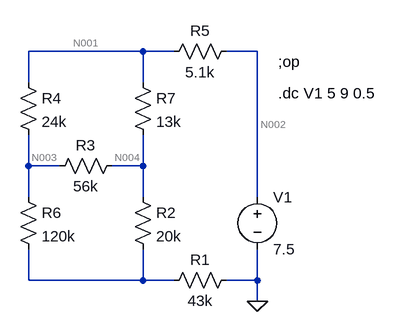
[diagram p0: schematic lab4.asc]
lab4.asc, the LTspice schematic file:
Version 4
SHEET 1 880 680
WIRE 208 -80 32 -80
WIRE 256 -80 208 -80
WIRE 384 -80 336 -80
WIRE 32 -32 32 -80
WIRE 208 -32 208 -80
WIRE 32 96 32 48
WIRE 80 96 32 96
WIRE 208 96 208 48
WIRE 208 96 160 96
WIRE 32 144 32 96
WIRE 208 144 208 96
WIRE 384 144 384 -80
WIRE 32 272 32 224
WIRE 208 272 208 224
WIRE 208 272 32 272
WIRE 256 272 208 272
WIRE 384 272 384 224
WIRE 384 272 336 272
WIRE 384 304 384 272
FLAG 384 304 0
SYMBOL res 352 256 R90
WINDOW 0 0 56 VBottom 2
WINDOW 3 32 56 VTop 2
SYMATTR InstName R1
SYMATTR Value 43k
SYMBOL res 192 128 R0
SYMATTR InstName R2
SYMATTR Value 20k
SYMBOL res 176 80 R90
WINDOW 0 0 56 VBottom 2
WINDOW 3 32 56 VTop 2
SYMATTR InstName R3
SYMATTR Value 56k
SYMBOL res 16 -48 R0
SYMATTR InstName R4
SYMATTR Value 24k
SYMBOL res 352 -96 R90
WINDOW 0 0 56 VBottom 2
WINDOW 3 32 56 VTop 2
SYMATTR InstName R5
SYMATTR Value 5.1k
SYMBOL res 16 128 R0
SYMATTR InstName R6
SYMATTR Value 120k
SYMBOL res 192 -48 R0
SYMATTR InstName R7
SYMATTR Value 13k
SYMBOL voltage 384 128 R0
WINDOW 123 0 0 Left 2
WINDOW 39 0 0 Left 2
SYMATTR InstName V1
SYMATTR Value 7.5
TEXT 416 -64 Left 2 !;op
TEXT 416 -16 Left 2 !.dc V1 5 9 0.5

The netlist it stands for:
* lab4.asc
R1 0 N005 43k
R2 N004 N005 20k
R3 N004 N003 56k
R4 N001 N003 24k
R5 N002 N001 5.1k
R6 N003 N005 120k
R7 N001 N004 13k
V1 N002 0 7.5
;op
.dc V1 5 9 0.5
.backanno
.end

* Results of the author's LTspice run, read from the files saved beside the schematic
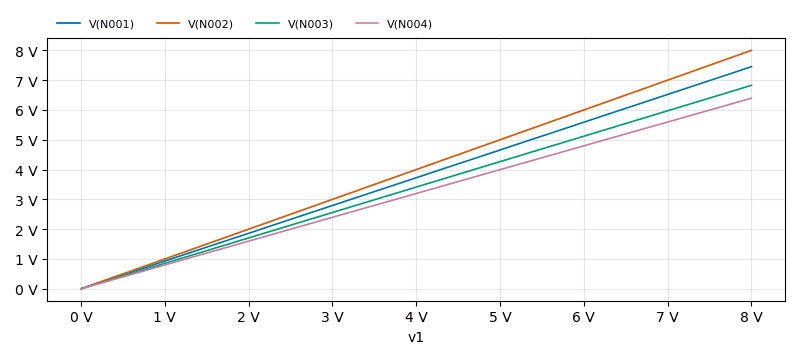
[diagram p1: DC transfer characteristic of lab4.asc, plotted from the saved traces]
* DC transfer characteristic, 1 run:
*   V(N001): 0 V at v1=0 V, 7.452 V at v1=8 V, min 0 V, max 7.452 V
*   V(N002): 0 V at v1=0 V, 8 V at v1=8 V, min 0 V, max 8 V
*   V(N003): 0 V at v1=0 V, 6.826 V at v1=8 V, min 0 V, max 6.826 V
*   V(N004): 0 V at v1=0 V, 6.396 V at v1=8 V, min 0 V, max 6.396 V